# Altium schematic sheet FPGA.SchDoc
size A3
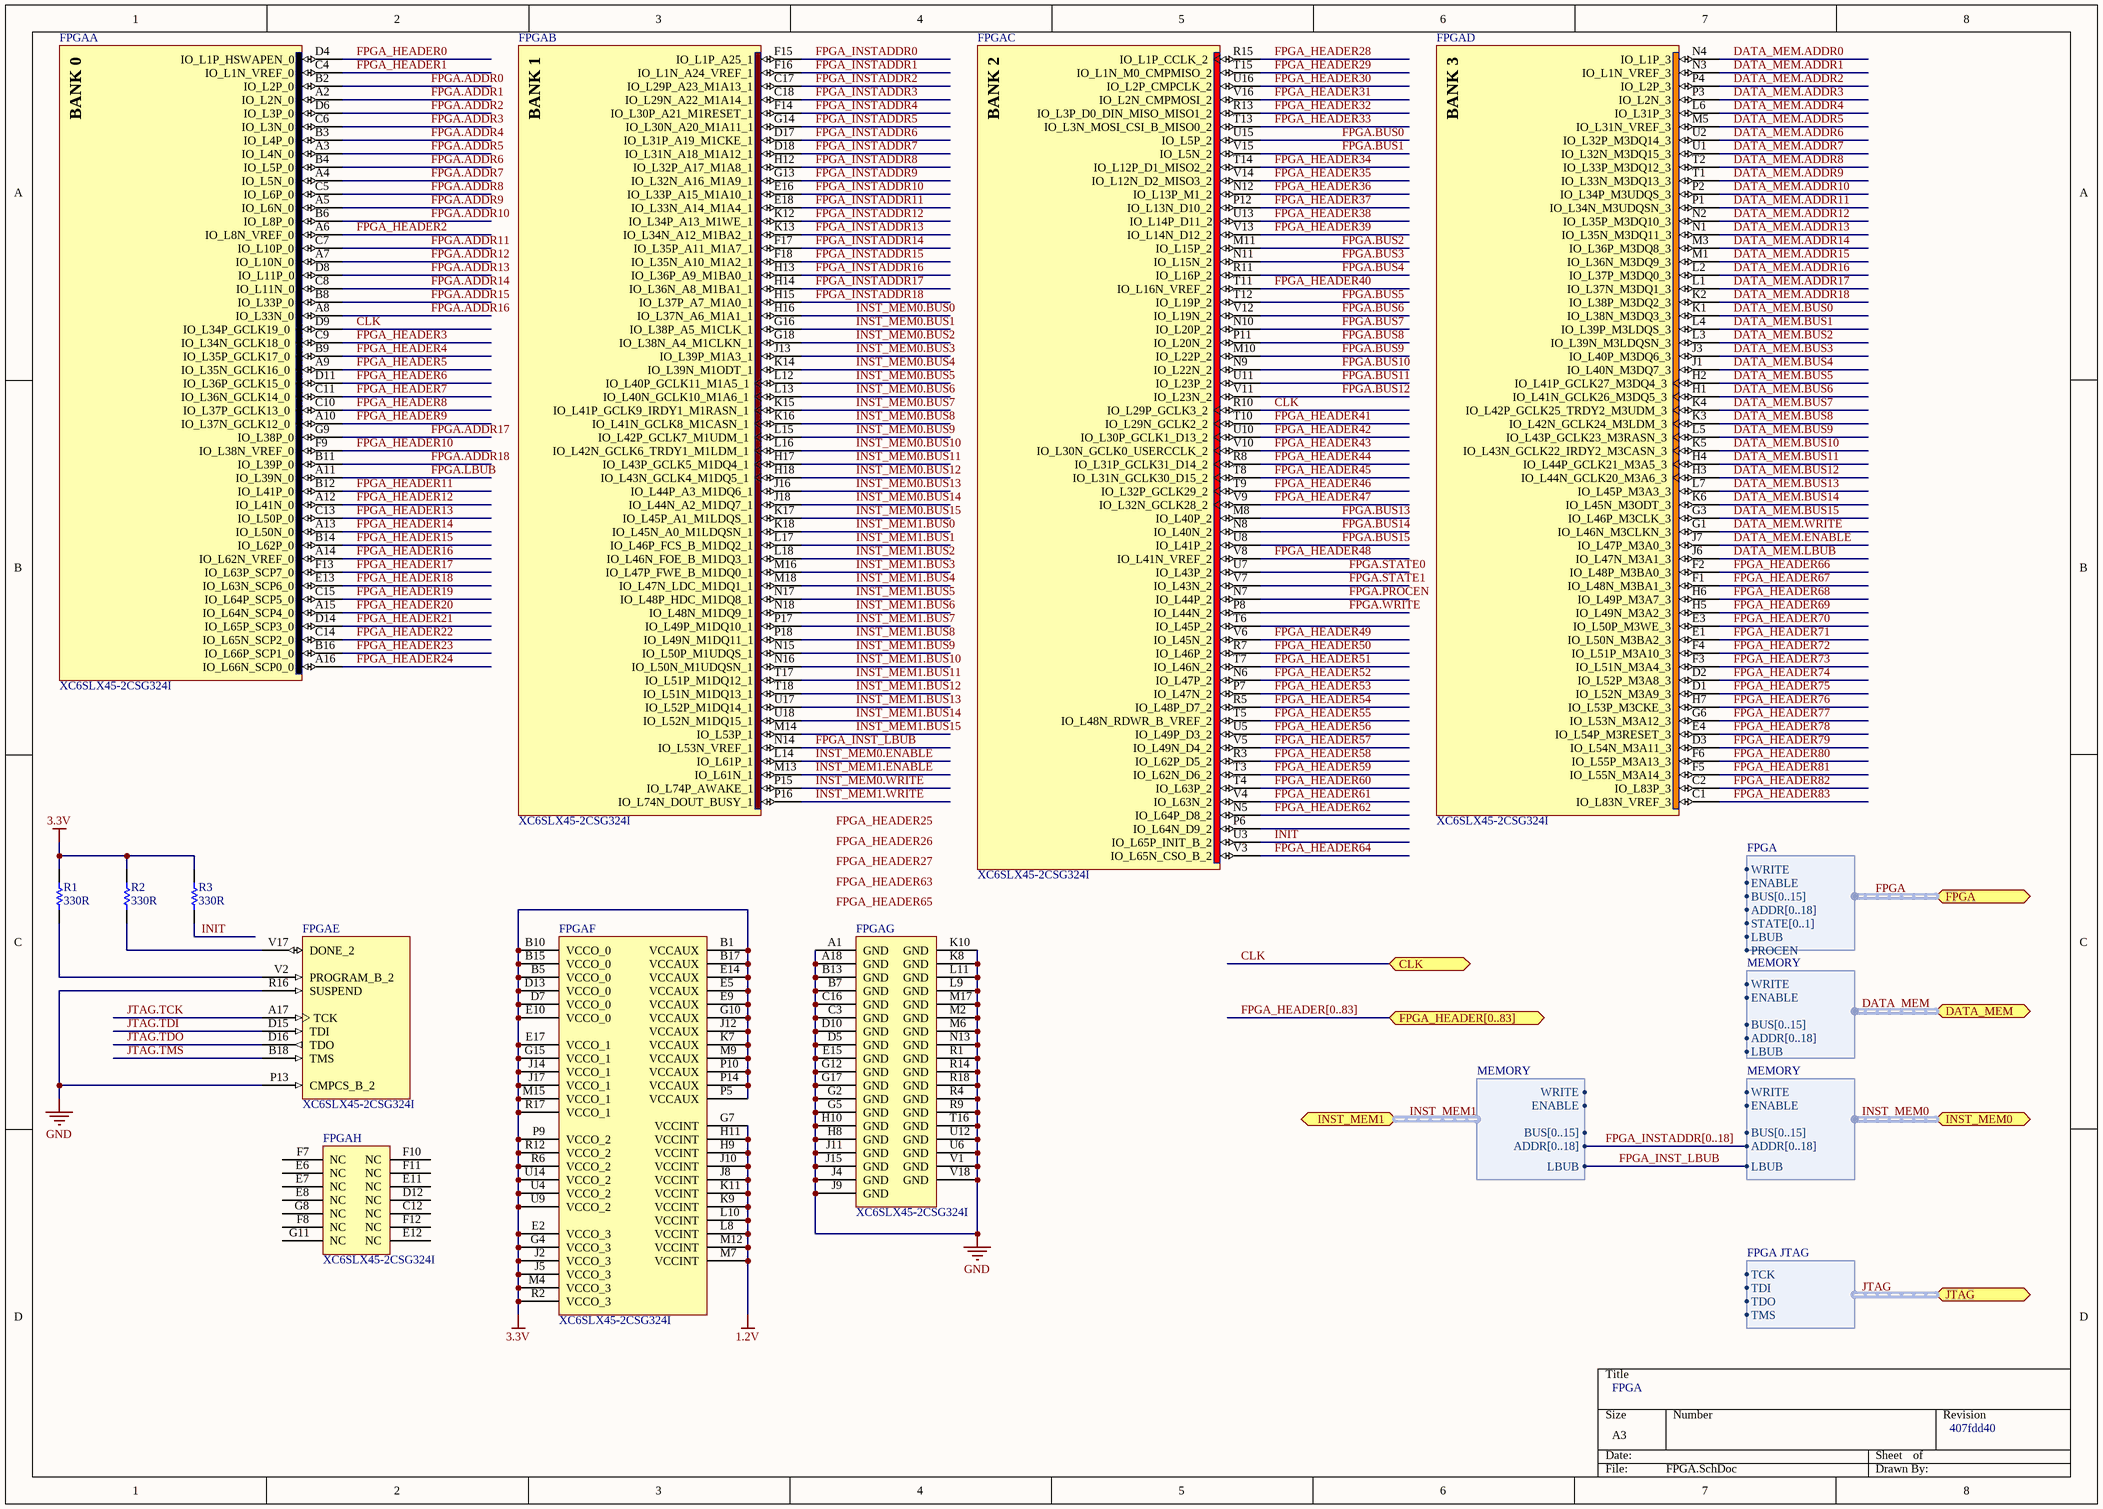
[diagram p0: FPGA.SchDoc]

## Parts
FPGA  XC6SLX45-2CSG324I  [CSG324]  (parts A,B,C,D,E,F,G,H of 8)
R1  value 330R  [RESC1206(3216)_M]  (hidden comment: 330R 5% 1206(3216))
R2  value 330R  [RESC1206(3216)_M]  (hidden comment: 330R 5% 1206(3216))
R3  value 330R  [RESC1206(3216)_M]  (hidden comment: 330R 5% 1206(3216))

## Ports
CLK (bidir), DATA_MEM (harness MEMORY), FPGA (harness FPGA), FPGA_HEADER[0..83] (bidir), INST_MEM0 (harness MEMORY), INST_MEM1 (harness MEMORY), JTAG (harness FPGA JTAG)

## Harnesses
FPGA JTAG: TCK, TDI, TMS, TDO
MEMORY: WRITE, ENABLE, ADDR[0..18], BUS[0..15], LBUB
FPGA: WRITE, ENABLE, ADDR[0..18], STATE[0..1], BUS[0..15], LBUB, PROCEN

## Nets
1.2V: FPGA.G7(VCCINT) FPGA.H9(VCCINT) FPGA.H11(VCCINT) FPGA.J8(VCCINT) FPGA.J10(VCCINT) FPGA.K9(VCCINT) FPGA.K11(VCCINT) FPGA.L8(VCCINT) FPGA.L10(VCCINT) FPGA.M7(VCCINT) FPGA.M12(VCCINT)
3.3V: FPGA.B1(VCCAUX) FPGA.B5(VCCO_0) FPGA.B10(VCCO_0) FPGA.B15(VCCO_0) FPGA.B17(VCCAUX) FPGA.D7(VCCO_0) FPGA.D13(VCCO_0) FPGA.E2(VCCO_3) FPGA.E5(VCCAUX) FPGA.E9(VCCAUX) FPGA.E10(VCCO_0) FPGA.E14(VCCAUX) FPGA.E17(VCCO_1) FPGA.G4(VCCO_3) FPGA.G10(VCCAUX) FPGA.G15(VCCO_1) FPGA.J2(VCCO_3) FPGA.J5(VCCO_3) FPGA.J12(VCCAUX) FPGA.J14(VCCO_1) FPGA.J17(VCCO_1) FPGA.K7(VCCAUX) FPGA.M4(VCCO_3) FPGA.M9(VCCAUX) FPGA.M15(VCCO_1) FPGA.P5(VCCAUX) FPGA.P9(VCCO_2) FPGA.P10(VCCAUX) FPGA.P14(VCCAUX) FPGA.R2(VCCO_3) FPGA.R6(VCCO_2) FPGA.R12(VCCO_2) FPGA.R17(VCCO_1) FPGA.U4(VCCO_2) FPGA.U9(VCCO_2) FPGA.U14(VCCO_2) R1.2 R2.2 R3.2
GND: FPGA.A1(GND) FPGA.A18(GND) FPGA.B7(GND) FPGA.B13(GND) FPGA.C3(GND) FPGA.C16(GND) FPGA.D5(GND) FPGA.D10(GND) FPGA.E15(GND) FPGA.G2(GND) FPGA.G5(GND) FPGA.G12(GND) FPGA.G17(GND) FPGA.H8(GND) FPGA.H10(GND) FPGA.J4(GND) FPGA.J9(GND) FPGA.J11(GND) FPGA.J15(GND) FPGA.K8(GND) FPGA.K10(GND) FPGA.L9(GND) FPGA.L11(GND) FPGA.M2(GND) FPGA.M6(GND) FPGA.M17(GND) FPGA.N13(GND) FPGA.P13(CMPCS_B_2) FPGA.R1(GND) FPGA.R4(GND) FPGA.R9(GND) FPGA.R14(GND) FPGA.R16(SUSPEND) FPGA.R18(GND) FPGA.T16(GND) FPGA.U6(GND) FPGA.U12(GND) FPGA.V1(GND) FPGA.V18(GND)
CLK: FPGA.D9(IO_L34P_GCLK19_0) FPGA.R10(IO_L29P_GCLK3_2) ; port CLK
DATA_MEM.ADDR0: FPGA.N4(IO_L1P_3)
DATA_MEM.ADDR1: FPGA.N3(IO_L1N_VREF_3)
DATA_MEM.ADDR2: FPGA.P4(IO_L2P_3)
DATA_MEM.ADDR3: FPGA.P3(IO_L2N_3)
DATA_MEM.ADDR4: FPGA.L6(IO_L31P_3)
DATA_MEM.ADDR5: FPGA.M5(IO_L31N_VREF_3)
DATA_MEM.ADDR6: FPGA.U2(IO_L32P_M3DQ14_3)
DATA_MEM.ADDR7: FPGA.U1(IO_L32N_M3DQ15_3)
DATA_MEM.ADDR8: FPGA.T2(IO_L33P_M3DQ12_3)
DATA_MEM.ADDR9: FPGA.T1(IO_L33N_M3DQ13_3)
DATA_MEM.ADDR10: FPGA.P2(IO_L34P_M3UDQS_3)
DATA_MEM.ADDR11: FPGA.P1(IO_L34N_M3UDQSN_3)
DATA_MEM.ADDR12: FPGA.N2(IO_L35P_M3DQ10_3)
DATA_MEM.ADDR13: FPGA.N1(IO_L35N_M3DQ11_3)
DATA_MEM.ADDR14: FPGA.M3(IO_L36P_M3DQ8_3)
DATA_MEM.ADDR15: FPGA.M1(IO_L36N_M3DQ9_3)
DATA_MEM.ADDR16: FPGA.L2(IO_L37P_M3DQ0_3)
DATA_MEM.ADDR17: FPGA.L1(IO_L37N_M3DQ1_3)
DATA_MEM.ADDR18: FPGA.K2(IO_L38P_M3DQ2_3)
DATA_MEM.BUS0: FPGA.K1(IO_L38N_M3DQ3_3)
DATA_MEM.BUS1: FPGA.L4(IO_L39P_M3LDQS_3)
DATA_MEM.BUS2: FPGA.L3(IO_L39N_M3LDQSN_3)
DATA_MEM.BUS3: FPGA.J3(IO_L40P_M3DQ6_3)
DATA_MEM.BUS4: FPGA.J1(IO_L40N_M3DQ7_3)
DATA_MEM.BUS5: FPGA.H2(IO_L41P_GCLK27_M3DQ4_3)
DATA_MEM.BUS6: FPGA.H1(IO_L41N_GCLK26_M3DQ5_3)
DATA_MEM.BUS7: FPGA.K4(IO_L42P_GCLK25_TRDY2_M3UDM_3)
DATA_MEM.BUS8: FPGA.K3(IO_L42N_GCLK24_M3LDM_3)
DATA_MEM.BUS9: FPGA.L5(IO_L43P_GCLK23_M3RASN_3)
DATA_MEM.BUS10: FPGA.K5(IO_L43N_GCLK22_IRDY2_M3CASN_3)
DATA_MEM.BUS11: FPGA.H4(IO_L44P_GCLK21_M3A5_3)
DATA_MEM.BUS12: FPGA.H3(IO_L44N_GCLK20_M3A6_3)
DATA_MEM.BUS13: FPGA.L7(IO_L45P_M3A3_3)
DATA_MEM.BUS14: FPGA.K6(IO_L45N_M3ODT_3)
DATA_MEM.BUS15: FPGA.G3(IO_L46P_M3CLK_3)
DATA_MEM.ENABLE: FPGA.J7(IO_L47P_M3A0_3)
DATA_MEM.LBUB: FPGA.J6(IO_L47N_M3A1_3)
DATA_MEM.WRITE: FPGA.G1(IO_L46N_M3CLKN_3)
FPGA.ADDR0: FPGA.B2(IO_L2P_0)
FPGA.ADDR1: FPGA.A2(IO_L2N_0)
FPGA.ADDR2: FPGA.D6(IO_L3P_0)
FPGA.ADDR3: FPGA.C6(IO_L3N_0)
FPGA.ADDR4: FPGA.B3(IO_L4P_0)
FPGA.ADDR5: FPGA.A3(IO_L4N_0)
FPGA.ADDR6: FPGA.B4(IO_L5P_0)
FPGA.ADDR7: FPGA.A4(IO_L5N_0)
FPGA.ADDR8: FPGA.C5(IO_L6P_0)
FPGA.ADDR9: FPGA.A5(IO_L6N_0)
FPGA.ADDR10: FPGA.B6(IO_L8P_0)
FPGA.ADDR11: FPGA.C7(IO_L10P_0)
FPGA.ADDR12: FPGA.A7(IO_L10N_0)
FPGA.ADDR13: FPGA.D8(IO_L11P_0)
FPGA.ADDR14: FPGA.C8(IO_L11N_0)
FPGA.ADDR15: FPGA.B8(IO_L33P_0)
FPGA.ADDR16: FPGA.A8(IO_L33N_0)
FPGA.ADDR17: FPGA.G9(IO_L38P_0)
FPGA.ADDR18: FPGA.B11(IO_L39P_0)
FPGA.BUS0: FPGA.U15(IO_L5P_2)
FPGA.BUS1: FPGA.V15(IO_L5N_2)
FPGA.BUS2: FPGA.M11(IO_L15P_2)
FPGA.BUS3: FPGA.N11(IO_L15N_2)
FPGA.BUS4: FPGA.R11(IO_L16P_2)
FPGA.BUS5: FPGA.T12(IO_L19P_2)
FPGA.BUS6: FPGA.V12(IO_L19N_2)
FPGA.BUS7: FPGA.N10(IO_L20P_2)
FPGA.BUS8: FPGA.P11(IO_L20N_2)
FPGA.BUS9: FPGA.M10(IO_L22P_2)
FPGA.BUS10: FPGA.N9(IO_L22N_2)
FPGA.BUS11: FPGA.U11(IO_L23P_2)
FPGA.BUS12: FPGA.V11(IO_L23N_2)
FPGA.BUS13: FPGA.M8(IO_L40P_2)
FPGA.BUS14: FPGA.N8(IO_L40N_2)
FPGA.BUS15: FPGA.U8(IO_L41P_2)
FPGA.LBUB: FPGA.A11(IO_L39N_0)
FPGA.PROCEN: FPGA.N7(IO_L44P_2)
FPGA.STATE0: FPGA.U7(IO_L43P_2)
FPGA.STATE1: FPGA.V7(IO_L43N_2)
FPGA.WRITE: FPGA.P8(IO_L44N_2)
FPGA_HEADER0: FPGA.D4(IO_L1P_HSWAPEN_0)
FPGA_HEADER1: FPGA.C4(IO_L1N_VREF_0)
FPGA_HEADER2: FPGA.A6(IO_L8N_VREF_0)
FPGA_HEADER3: FPGA.C9(IO_L34N_GCLK18_0)
FPGA_HEADER4: FPGA.B9(IO_L35P_GCLK17_0)
FPGA_HEADER5: FPGA.A9(IO_L35N_GCLK16_0)
FPGA_HEADER6: FPGA.D11(IO_L36P_GCLK15_0)
FPGA_HEADER7: FPGA.C11(IO_L36N_GCLK14_0)
FPGA_HEADER8: FPGA.C10(IO_L37P_GCLK13_0)
FPGA_HEADER9: FPGA.A10(IO_L37N_GCLK12_0)
FPGA_HEADER10: FPGA.F9(IO_L38N_VREF_0)
FPGA_HEADER11: FPGA.B12(IO_L41P_0)
FPGA_HEADER12: FPGA.A12(IO_L41N_0)
FPGA_HEADER13: FPGA.C13(IO_L50P_0)
FPGA_HEADER14: FPGA.A13(IO_L50N_0)
FPGA_HEADER15: FPGA.B14(IO_L62P_0)
FPGA_HEADER16: FPGA.A14(IO_L62N_VREF_0)
FPGA_HEADER17: FPGA.F13(IO_L63P_SCP7_0)
FPGA_HEADER18: FPGA.E13(IO_L63N_SCP6_0)
FPGA_HEADER19: FPGA.C15(IO_L64P_SCP5_0)
FPGA_HEADER20: FPGA.A15(IO_L64N_SCP4_0)
FPGA_HEADER21: FPGA.D14(IO_L65P_SCP3_0)
FPGA_HEADER22: FPGA.C14(IO_L65N_SCP2_0)
FPGA_HEADER23: FPGA.B16(IO_L66P_SCP1_0)
FPGA_HEADER24: FPGA.A16(IO_L66N_SCP0_0)
FPGA_HEADER28: FPGA.R15(IO_L1P_CCLK_2)
FPGA_HEADER29: FPGA.T15(IO_L1N_M0_CMPMISO_2)
FPGA_HEADER30: FPGA.U16(IO_L2P_CMPCLK_2)
FPGA_HEADER31: FPGA.V16(IO_L2N_CMPMOSI_2)
FPGA_HEADER32: FPGA.R13(IO_L3P_D0_DIN_MISO_MISO1_2)
FPGA_HEADER33: FPGA.T13(IO_L3N_MOSI_CSI_B_MISO0_2)
FPGA_HEADER34: FPGA.T14(IO_L12P_D1_MISO2_2)
FPGA_HEADER35: FPGA.V14(IO_L12N_D2_MISO3_2)
FPGA_HEADER36: FPGA.N12(IO_L13P_M1_2)
FPGA_HEADER37: FPGA.P12(IO_L13N_D10_2)
FPGA_HEADER38: FPGA.U13(IO_L14P_D11_2)
FPGA_HEADER39: FPGA.V13(IO_L14N_D12_2)
FPGA_HEADER40: FPGA.T11(IO_L16N_VREF_2)
FPGA_HEADER41: FPGA.T10(IO_L29N_GCLK2_2)
FPGA_HEADER42: FPGA.U10(IO_L30P_GCLK1_D13_2)
FPGA_HEADER43: FPGA.V10(IO_L30N_GCLK0_USERCCLK_2)
FPGA_HEADER44: FPGA.R8(IO_L31P_GCLK31_D14_2)
FPGA_HEADER45: FPGA.T8(IO_L31N_GCLK30_D15_2)
FPGA_HEADER46: FPGA.T9(IO_L32P_GCLK29_2)
FPGA_HEADER47: FPGA.V9(IO_L32N_GCLK28_2)
FPGA_HEADER48: FPGA.V8(IO_L41N_VREF_2)
FPGA_HEADER49: FPGA.V6(IO_L45N_2)
FPGA_HEADER50: FPGA.R7(IO_L46P_2)
FPGA_HEADER51: FPGA.T7(IO_L46N_2)
FPGA_HEADER52: FPGA.N6(IO_L47P_2)
FPGA_HEADER53: FPGA.P7(IO_L47N_2)
FPGA_HEADER54: FPGA.R5(IO_L48P_D7_2)
FPGA_HEADER55: FPGA.T5(IO_L48N_RDWR_B_VREF_2)
FPGA_HEADER56: FPGA.U5(IO_L49P_D3_2)
FPGA_HEADER57: FPGA.V5(IO_L49N_D4_2)
FPGA_HEADER58: FPGA.R3(IO_L62P_D5_2)
FPGA_HEADER59: FPGA.T3(IO_L62N_D6_2)
FPGA_HEADER60: FPGA.T4(IO_L63P_2)
FPGA_HEADER61: FPGA.V4(IO_L63N_2)
FPGA_HEADER62: FPGA.N5(IO_L64P_D8_2)
FPGA_HEADER64: FPGA.V3(IO_L65N_CSO_B_2)
FPGA_HEADER66: FPGA.F2(IO_L48P_M3BA0_3)
FPGA_HEADER67: FPGA.F1(IO_L48N_M3BA1_3)
FPGA_HEADER68: FPGA.H6(IO_L49P_M3A7_3)
FPGA_HEADER69: FPGA.H5(IO_L49N_M3A2_3)
FPGA_HEADER70: FPGA.E3(IO_L50P_M3WE_3)
FPGA_HEADER71: FPGA.E1(IO_L50N_M3BA2_3)
FPGA_HEADER72: FPGA.F4(IO_L51P_M3A10_3)
FPGA_HEADER73: FPGA.F3(IO_L51N_M3A4_3)
FPGA_HEADER74: FPGA.D2(IO_L52P_M3A8_3)
FPGA_HEADER75: FPGA.D1(IO_L52N_M3A9_3)
FPGA_HEADER76: FPGA.H7(IO_L53P_M3CKE_3)
FPGA_HEADER77: FPGA.G6(IO_L53N_M3A12_3)
FPGA_HEADER78: FPGA.E4(IO_L54P_M3RESET_3)
FPGA_HEADER79: FPGA.D3(IO_L54N_M3A11_3)
FPGA_HEADER80: FPGA.F6(IO_L55P_M3A13_3)
FPGA_HEADER81: FPGA.F5(IO_L55N_M3A14_3)
FPGA_HEADER82: FPGA.C2(IO_L83P_3)
FPGA_HEADER83: FPGA.C1(IO_L83N_VREF_3)
FPGA_INST_LBUB: FPGA.N14(IO_L53N_VREF_1) ; port INST_MEM0.LBUB, port INST_MEM1.LBUB
FPGA_INSTADDR0: FPGA.F15(IO_L1P_A25_1)
FPGA_INSTADDR1: FPGA.F16(IO_L1N_A24_VREF_1)
FPGA_INSTADDR2: FPGA.C17(IO_L29P_A23_M1A13_1)
FPGA_INSTADDR3: FPGA.C18(IO_L29N_A22_M1A14_1)
FPGA_INSTADDR4: FPGA.F14(IO_L30P_A21_M1RESET_1)
FPGA_INSTADDR5: FPGA.G14(IO_L30N_A20_M1A11_1)
FPGA_INSTADDR6: FPGA.D17(IO_L31P_A19_M1CKE_1)
FPGA_INSTADDR7: FPGA.D18(IO_L31N_A18_M1A12_1)
FPGA_INSTADDR8: FPGA.H12(IO_L32P_A17_M1A8_1)
FPGA_INSTADDR9: FPGA.G13(IO_L32N_A16_M1A9_1)
FPGA_INSTADDR10: FPGA.E16(IO_L33P_A15_M1A10_1)
FPGA_INSTADDR11: FPGA.E18(IO_L33N_A14_M1A4_1)
FPGA_INSTADDR12: FPGA.K12(IO_L34P_A13_M1WE_1)
FPGA_INSTADDR13: FPGA.K13(IO_L34N_A12_M1BA2_1)
FPGA_INSTADDR14: FPGA.F17(IO_L35P_A11_M1A7_1)
FPGA_INSTADDR15: FPGA.F18(IO_L35N_A10_M1A2_1)
FPGA_INSTADDR16: FPGA.H13(IO_L36P_A9_M1BA0_1)
FPGA_INSTADDR17: FPGA.H14(IO_L36N_A8_M1BA1_1)
FPGA_INSTADDR18: FPGA.H15(IO_L37P_A7_M1A0_1)
INIT: FPGA.U3(IO_L65P_INIT_B_2) R3.1
INST_MEM0.BUS0: FPGA.H16(IO_L37N_A6_M1A1_1)
INST_MEM0.BUS1: FPGA.G16(IO_L38P_A5_M1CLK_1)
INST_MEM0.BUS2: FPGA.G18(IO_L38N_A4_M1CLKN_1)
INST_MEM0.BUS3: FPGA.J13(IO_L39P_M1A3_1)
INST_MEM0.BUS4: FPGA.K14(IO_L39N_M1ODT_1)
INST_MEM0.BUS5: FPGA.L12(IO_L40P_GCLK11_M1A5_1)
INST_MEM0.BUS6: FPGA.L13(IO_L40N_GCLK10_M1A6_1)
INST_MEM0.BUS7: FPGA.K15(IO_L41P_GCLK9_IRDY1_M1RASN_1)
INST_MEM0.BUS8: FPGA.K16(IO_L41N_GCLK8_M1CASN_1)
INST_MEM0.BUS9: FPGA.L15(IO_L42P_GCLK7_M1UDM_1)
INST_MEM0.BUS10: FPGA.L16(IO_L42N_GCLK6_TRDY1_M1LDM_1)
INST_MEM0.BUS11: FPGA.H17(IO_L43P_GCLK5_M1DQ4_1)
INST_MEM0.BUS12: FPGA.H18(IO_L43N_GCLK4_M1DQ5_1)
INST_MEM0.BUS13: FPGA.J16(IO_L44P_A3_M1DQ6_1)
INST_MEM0.BUS14: FPGA.J18(IO_L44N_A2_M1DQ7_1)
INST_MEM0.BUS15: FPGA.K17(IO_L45P_A1_M1LDQS_1)
INST_MEM0.ENABLE: FPGA.L14(IO_L61P_1)
INST_MEM0.WRITE: FPGA.P15(IO_L74P_AWAKE_1)
INST_MEM1.BUS0: FPGA.K18(IO_L45N_A0_M1LDQSN_1)
INST_MEM1.BUS1: FPGA.L17(IO_L46P_FCS_B_M1DQ2_1)
INST_MEM1.BUS2: FPGA.L18(IO_L46N_FOE_B_M1DQ3_1)
INST_MEM1.BUS3: FPGA.M16(IO_L47P_FWE_B_M1DQ0_1)
INST_MEM1.BUS4: FPGA.M18(IO_L47N_LDC_M1DQ1_1)
INST_MEM1.BUS5: FPGA.N17(IO_L48P_HDC_M1DQ8_1)
INST_MEM1.BUS6: FPGA.N18(IO_L48N_M1DQ9_1)
INST_MEM1.BUS7: FPGA.P17(IO_L49P_M1DQ10_1)
INST_MEM1.BUS8: FPGA.P18(IO_L49N_M1DQ11_1)
INST_MEM1.BUS9: FPGA.N15(IO_L50P_M1UDQS_1)
INST_MEM1.BUS10: FPGA.N16(IO_L50N_M1UDQSN_1)
INST_MEM1.BUS11: FPGA.T17(IO_L51P_M1DQ12_1)
INST_MEM1.BUS12: FPGA.T18(IO_L51N_M1DQ13_1)
INST_MEM1.BUS13: FPGA.U17(IO_L52P_M1DQ14_1)
INST_MEM1.BUS14: FPGA.U18(IO_L52N_M1DQ15_1)
INST_MEM1.BUS15: FPGA.M14(IO_L53P_1)
INST_MEM1.ENABLE: FPGA.M13(IO_L61N_1)
INST_MEM1.WRITE: FPGA.P16(IO_L74N_DOUT_BUSY_1)
JTAG.TCK: FPGA.A17(TCK)
JTAG.TDI: FPGA.D15(TDI)
JTAG.TDO: FPGA.D16(TDO)
JTAG.TMS: FPGA.B18(TMS)
NetFPGA_V2: FPGA.V2(PROGRAM_B_2) R1.1
NetFPGA_V17: FPGA.V17(DONE_2) R2.1

Not connected (* = marked no-connect by the designer): FPGA C12(NC) D12(NC) E6(NC) E7(NC) E8(NC) E11(NC) E12(NC) F7(NC) F8(NC) F10(NC) F11(NC) F12(NC) G8(NC) G11(NC) P6(IO_L64N_D9_2) T6(IO_L45P_2)

## Buses and harness runs
bus FPGA_HEADER[0..83] = port FPGA_HEADER[0..83]
bus FPGA_INSTADDR[0..18]
harness DATA_MEM = port DATA_MEM
harness FPGA = port FPGA
harness INST_MEM0 = port INST_MEM0
harness INST_MEM1 = port INST_MEM1
harness JTAG = port JTAG

## Notes on the sheet
- FPGA
- 407fdd40
- Labels drawn without touching a wire or pin: FPGA_HEADER25, FPGA_HEADER26, FPGA_HEADER27, FPGA_HEADER63, FPGA_HEADER65
- (in symbol XC6SLX45-2CSG324I, part A) BANK 0
- (in symbol XC6SLX45-2CSG324I, part B) BANK 1
- (in symbol XC6SLX45-2CSG324I, part C) BANK 2
- (in symbol XC6SLX45-2CSG324I, part D) BANK 3

## Library data of the parts
FPGA = XC6SLX45-2CSG324I: Spartan-6 LX 1.2V FPGA, 218 User I/Os, 324-Ball Chip-Scale BGA (0.8mm Pitch), Speed Grade 2, Industrial Grade, Pb-Free; DatasheetVersion: ver1.6, Nov-2010; PackageVersion: ver1.1, Nov-2009; PackageReference: CSG324; PackageDescription: 324-Ball Chip-Scale BGA (CSG324) Package, 0.8 mm Pitch; Code_JEDEC: MO-275-KKAC-1; ComponentLink1Description: Manufacturer URL; ComponentLink1URL: http://www.xilinx.com/; ComponentLink2Description: Spartan-6 Datasheet; ComponentLink2URL: http://www.xilinx.com/support/documentation/data_sheets/ds160.pdf; ComponentLink3Description: Spartan-6 Documents; ComponentLink3URL: http://www.xilinx.com/support/documentation/spartan-6.htm
R1-R3 = CMP-1014-00062-1: 330R 0.25W 5% 1206 (3216 Metric)  SMD; Case-Metric: 3216; Case-EIA: 1206; Tolerance: 5 %; Technology: SMT; Power: 0.25 W